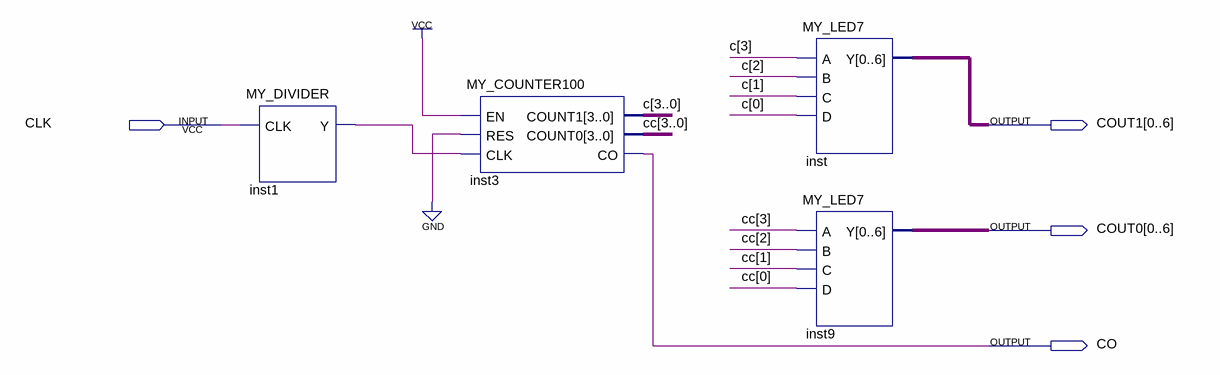
[diagram p0: schematic sheet]
// Quartus schematic TEST_COUNTER100.bdf as structural Verilog: 4 symbols, 4 pins
module TEST_COUNTER100 (
  input  CLK,
  output [0:6] COUT1,
  output [0:6] COUT0,
  output CO
);

  wire inst1_y;
  wire [3:0] c, cc;

  MY_DIVIDER inst1 (.CLK(CLK), .Y(inst1_y));
  MY_COUNTER100 inst3 (.EN(1'b1), .RES(1'b0), .CLK(inst1_y), .COUNT1(c), .COUNT0(cc), .CO(CO));
  MY_LED7 inst (.A(c[3]), .B(c[2]), .C(c[1]), .D(c[0]), .Y(COUT1));
  MY_LED7 inst9 (.A(cc[3]), .B(cc[2]), .C(cc[1]), .D(cc[0]), .Y(COUT0));
endmodule
